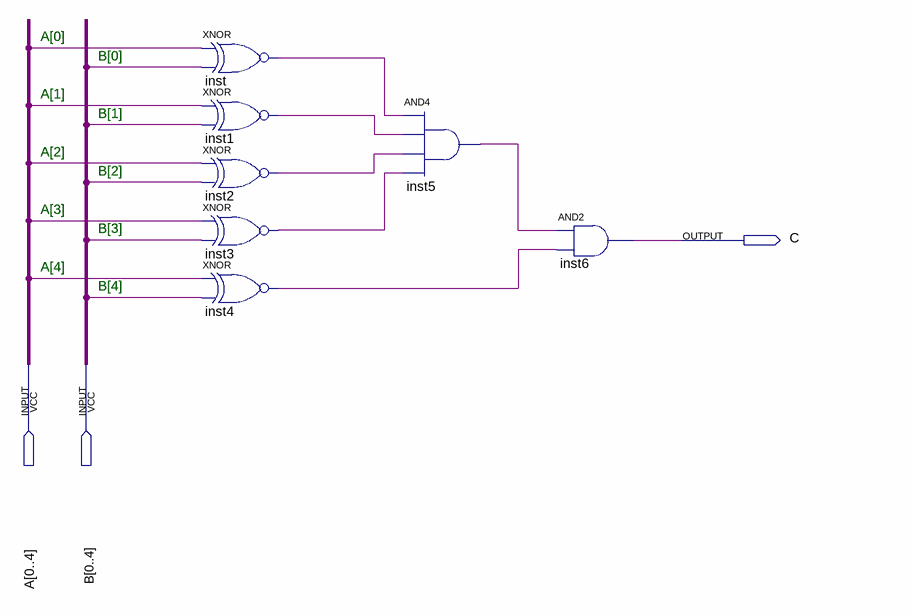
[diagram p0: schematic sheet]
// Quartus schematic EQUAL.bdf as structural Verilog: 7 symbols, 3 pins
module EQUAL (
  input  [0:4] A,
  input  [0:4] B,
  output C
);

  wire inst1_out, inst2_out, inst3_out, inst4_out, inst5_out, inst_out;

  xnor inst (inst_out, A[0], B[0]);
  xnor inst1 (inst1_out, A[1], B[1]);
  xnor inst2 (inst2_out, A[2], B[2]);
  xnor inst3 (inst3_out, A[3], B[3]);
  xnor inst4 (inst4_out, A[4], B[4]);
  and inst5 (inst5_out, inst_out, inst1_out, inst2_out, inst3_out);
  and inst6 (C, inst5_out, inst4_out);

  // Notes on the sheet:
  //   A[0]
  //   B[0]
  //   A[1]
  //   B[1]
  //   A[2]
  //   B[2]
  //   A[3]
  //   B[3]
  //   A[4]
  //   B[4]
endmodule
